# Altium schematic sheet USB_HUB1 DN PORT 4.SchDoc: USB_HUB 3.0
size A3; DrawnBy: Luca Schenetti; Revision: A; SheetNumber: 9; SheetTotal: 10
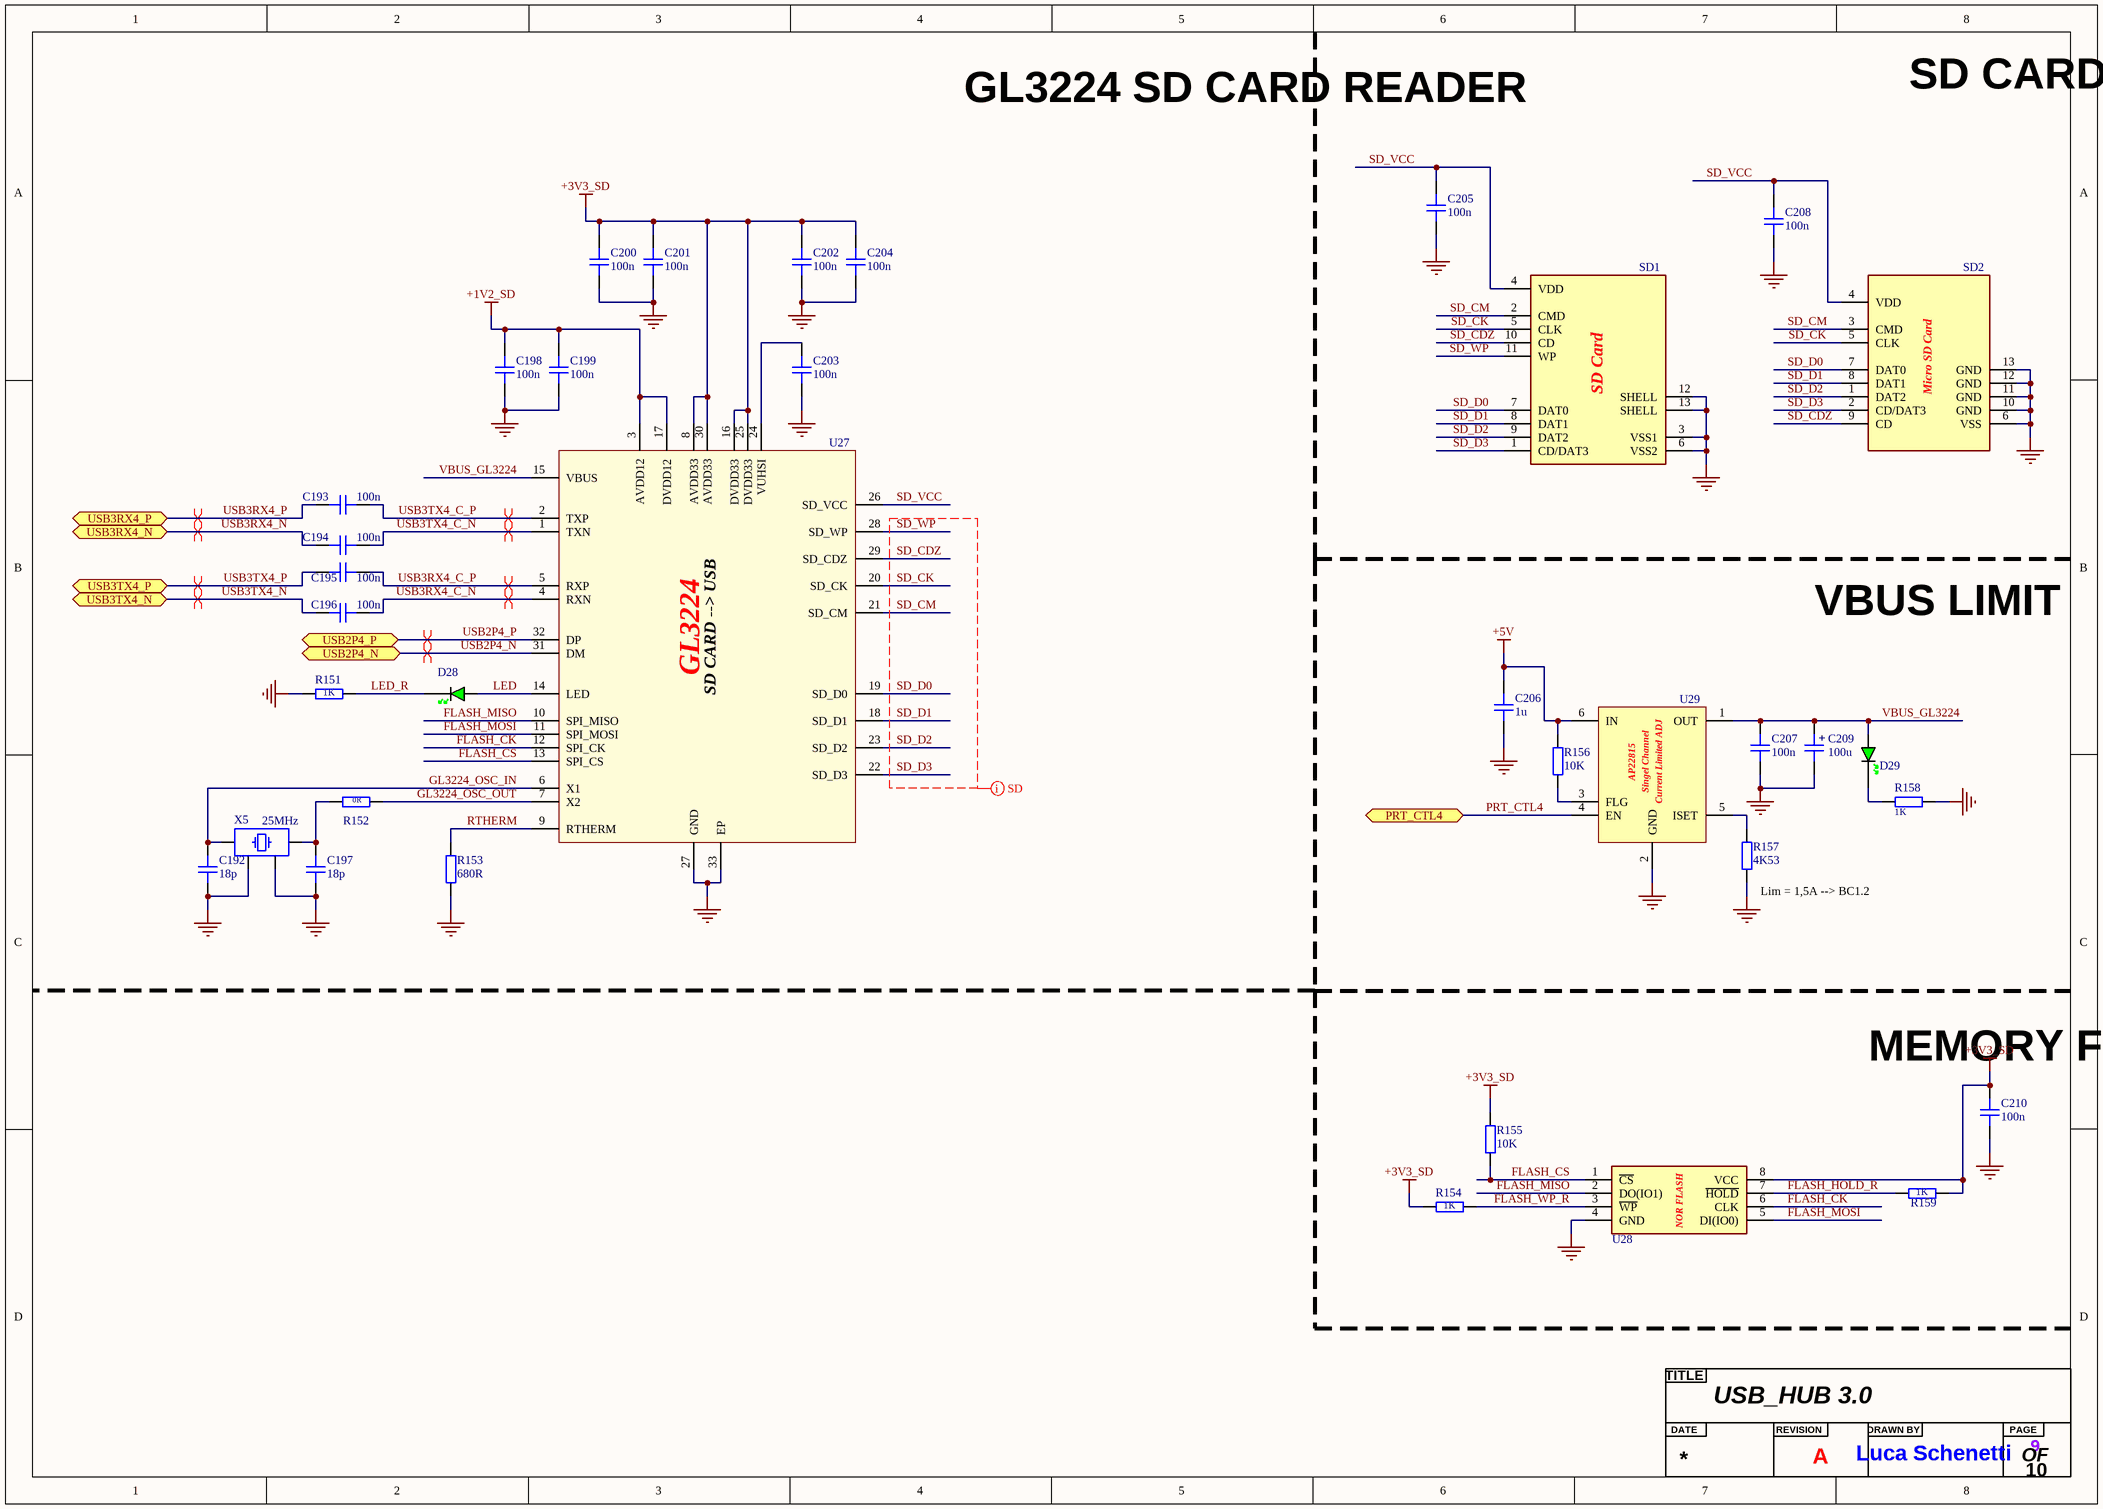
[diagram p0: USB_HUB1 DN PORT 4.SchDoc]

## Parts
?  Title  (value not drawn)  (graphical)
C192  18p  [CAP_0402]
C193  100n  [CAP_0402]
C194  100n  [CAP_0402]
C195  100n  [CAP_0402]
C196  100n  [CAP_0402]
C197  18p  [CAP_0402]
C198  100n  [CAP_0603]
C199  100n  [CAP_0603]
C200  100n  [CAP_0603]
C201  100n  [CAP_0603]
C202  100n  [CAP_0603]
C203  100n  [CAP_0603]
C204  100n  [CAP_0603]
C205  100n  [CAP_0603]
C206  1u  [CAP_0603]
C207  100n  [CAP_0603]
C208  100n  [CAP_0603]
C209  100u  [CAP_AE_SMD_D6MM3_H5M55]
C210  100n  [CAP_0603]
D28  GREEN  [LED_0603_GREEN]  (value not drawn)
D29  GREEN  [LED_0603_GREEN]  (value not drawn)
R151  1K  [RES_0603]
R152  0R  [RES_0402]
R153  680R  [RES_0603]
R154  1K  [RES_0603]
R155  10K  [RES_0603]
R156  10K  [RES_0603]
R157  4K53  [RES_0603]
R158  1K  [RES_0603]
R159  1K  [RES_0603]
SD1  Standard SD Card  [SD-106M]  (value not drawn)
SD2  Micro SD Card  [TF-01A]  (value not drawn)
U27  SD CARD TO USB 3.1  [GL3224-OIY04]  (value not drawn)
U28  NOR FLASH 2M-bit/256K-byte  [W25X20CLSNIG]  (value not drawn)
U29  Single-Channel, Current-Limited,ISET  [AP22615AWU-7]  (value not drawn)
X5  25MHz  [XTAL_3225]

## Ports
PRT_CTL4 (bidir, see USB_HUB1[6D]), USB2P4_N (bidir, see USB_HUB1[6C]), USB2P4_P (bidir, see USB_HUB1[6C]), USB3RX4_N (bidir, see USB_HUB1[6C]), USB3RX4_P (bidir, see USB_HUB1[6C]), USB3TX4_N (bidir, see USB_HUB1[6D]), USB3TX4_P (bidir, see USB_HUB1[6D])

## Nets
+1V2_SD: C198.2 C199.2 U27.3(AVDD12) U27.17(DVDD12)
+3V3_SD: C200.2 C201.2 C202.2 C204.2 C210.2 R154.2 R155.2 R159.1 U27.8(AVDD33) U27.16(DVDD33) U27.25(DVDD33) U27.30(AVDD33) U28.8(VCC)
+5V: C206.2 R156.2 U29.6(IN)
GND: C192.1 C197.1 C198.1 C199.1 C200.1 C201.1 C202.1 C203.1 C204.1 C205.1 C206.1 C207.1 C208.1 C209.2 C210.1 R151.2 R153.1 R157.1 R158.2 SD1.3(VSS1) SD1.6(VSS2) SD1.12(SHELL) SD1.13(SHELL) SD2.6(VSS) SD2.10(GND) SD2.11(GND) SD2.12(GND) SD2.13(GND) U27.27(GND) U27.33(EP) U28.4(GND) U29.2(GND) X5.2 X5.4
FLASH_CK: U27.12(SPI_CK) U28.6(CLK)
FLASH_CS: R155.1 U27.13(SPI_CS) U28.1(~{CS})
FLASH_HOLD_R: R159.2 U28.7(~{HOLD})
FLASH_MISO: U27.10(SPI_MISO) U28.2(DO(IO1))
FLASH_MOSI: U27.11(SPI_MOSI) U28.5(DI(IO0))
FLASH_WP_R: R154.1 U28.3(~{WP})
GL3224_OSC_IN: C192.2 U27.6(X1) X5.3
GL3224_OSC_OUT: R152.2 U27.7(X2)
LED: D28.A U27.14(LED)
LED_R: D28.K R151.1
PRT_CTL4: U29.4(EN) ; port PRT_CTL4
RTHERM: R153.2 U27.9(RTHERM)
SD_CDZ: SD1.10(CD) SD2.9(CD) U27.29(SD_CDZ)
SD_CK: SD1.5(CLK) SD2.5(CLK) U27.20(SD_CK)
SD_CM: SD1.2(CMD) SD2.3(CMD) U27.21(SD_CM)
SD_D0: SD1.7(DAT0) SD2.7(DAT0) U27.19(SD_D0)
SD_D1: SD1.8(DAT1) SD2.8(DAT1) U27.18(SD_D1)
SD_D2: SD1.9(DAT2) SD2.1(DAT2) U27.23(SD_D2)
SD_D3: SD1.1(CD/DAT3) SD2.2(CD/DAT3) U27.22(SD_D3)
SD_VCC: C205.2 C208.2 SD1.4(VDD) SD2.4(VDD) U27.26(SD_VCC)
SD_WP: SD1.11(WP) U27.28(SD_WP)
USB2P4_N: U27.31(DM) ; port USB2P4_N
USB2P4_P: U27.32(DP) ; port USB2P4_P
USB3RX4_C_N: C196.1 U27.4(RXN)
USB3RX4_C_P: C195.1 U27.5(RXP)
USB3RX4_N: C194.2 ; port USB3RX4_N
USB3RX4_P: C193.2 ; port USB3RX4_P
USB3TX4_C_N: C194.1 U27.1(TXN)
USB3TX4_C_P: C193.1 U27.2(TXP)
USB3TX4_N: C196.2 ; port USB3TX4_N
USB3TX4_P: C195.2 ; port USB3TX4_P
VBUS_GL3224: C207.2 C209.1 D29.A U27.15(VBUS) U29.1(OUT)
NetC197_2: C197.2 R152.1 X5.1
NetC203_2: C203.2 U27.24(VUHSI)
NetD29_K: D29.K R158.1
NetR156_1: R156.1 U29.3(FLG)
NetR157_2: R157.2 U29.5(ISET)

## Layout directives
net class SD; rule Matched Net Lengths [Delay Tolerance = 100ps]: SD_CDZ, SD_CK, SD_CM, SD_D0, SD_D1, SD_D2, SD_D3, SD_WP
differential pair; differential pair class DIFF_USB_90Ω: USB2P4_N, USB2P4_P, USB3RX4_C_N, USB3RX4_C_P, USB3RX4_N, USB3RX4_P, USB3TX4_C_N, USB3TX4_C_P, USB3TX4_N, USB3TX4_P

## Notes on the sheet
- GL3224 SD CARD READER
- SD CARD CONNECTOR
- VBUS LIMIT
- (near R157) Lim = 1,5A --> BC1.2
- MEMORY FLASH
- (in symbol AP22615AWU-7) AP22815; Singel Channel; Current Limited ADJ
- (in symbol CAP_ALEL_6.3x5.5) +
- (in symbol GL3224-OIY04) GL3224; SD CARD --> USB
- (in symbol SD-106M) SD Card
- (in symbol Title) TITLE; DATE; REVISION; DRAWN BY; PAGE; OF
- (in symbol W25X20CLSNIG) NOR FLASH

## Library data of the parts
C192 C197 = CAP_0402: Capacitor SMD 0402 [C1549]; Manufacturer: *; Manufacturer Part Number: *; Distributor Link: *; LCSC: *; Rating: *; Dielectric: *
C193-C196 = CAP_0402: Capacitor SMD 0402[C1525]; Manufacturer: *; Manufacturer Part Number: *; Distributor Link: *; LCSC: *; Rating: *; Dielectric: *
C198-C205 C207 C208 C210 = CAP_0603: Capacitor SMD 0603 [C14663]; Manufacturer: *; Manufacturer Part Number: *; Distributor Link: *; LCSC: *; Rating: *; Dielectric: *
C206 = CAP_0603: Capacitor SMD 0603 [C15849]; Manufacturer: *; Manufacturer Part Number: *; Distributor Link: *; LCSC: *; Rating: *; Dielectric: *
C209 = CAP_ALEL_6.3x5.5: [C59936]; Manufacturer: *; Manufacturer Part Number: *; Distributor Link: *; LCSC: *
D28 D29 = LED_0603_GREEN: [C2986059]
R151 R154 R158 R159 = RES_0603: [C21190]; Manufacturer: *; Manufacturer Part Number: *; Distributor Link: *; LCSC: *
R152 = RES_0402: Resistor SMD 0402 [C17168]; Manufacturer: *; Manufacturer Part Number: *; Distributor Link: *; LCSC: *
R153 = RES_0603: [C23228]; Manufacturer: *; Manufacturer Part Number: *; Distributor Link: *; LCSC: *
R155 R156 = RES_0603: [C25804]; Manufacturer: *; Manufacturer Part Number: *; Distributor Link: *; LCSC: *
R157 = RES_0603: [C25971]; Manufacturer: *; Manufacturer Part Number: *; Distributor Link: *; LCSC: *
SD1 = SD-106M: [C266603]
SD2 = TF-01A: [C2889258]
U27 = GL3224-OIY04: [C157357]
U28 = W25X20CLSNIG: [C409019]
U29 = AP22615AWU-7: [C2680357]
X5 = TSX-3225_24.0000MF15X-AC: Crystal SMD 24MHz 10PPM 7pF 3225 [C9006]; Manufacturer: Epson; Manufacturer Part Number: TSX-3225 24.0000MF15X-AC